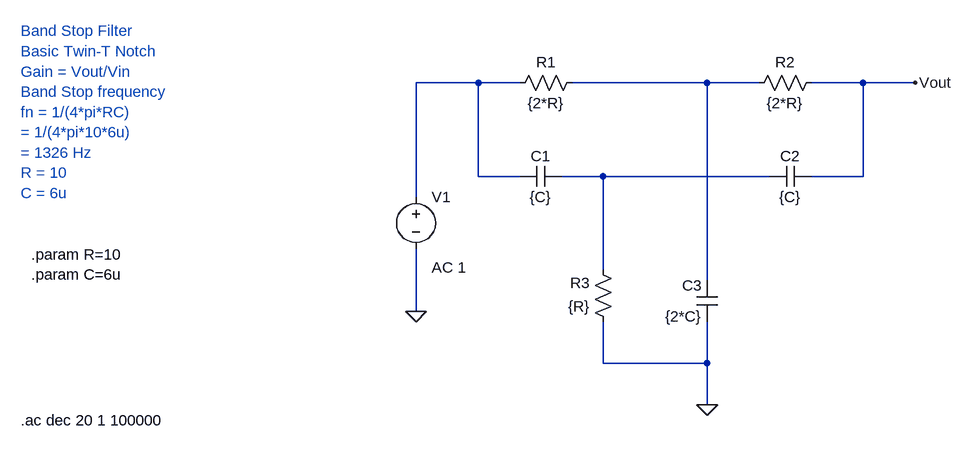
[diagram p0: schematic BandStopFilter.asc]
BandStopFilter.asc, the LTspice schematic file:
Version 4.1
SHEET 1 1368 680
WIRE 624 144 528 144
WIRE 688 144 624 144
WIRE 976 144 768 144
WIRE 1056 144 976 144
WIRE 1216 144 1136 144
WIRE 1296 144 1216 144
WIRE 624 288 624 144
WIRE 688 288 624 288
WIRE 816 288 752 288
WIRE 1072 288 816 288
WIRE 1216 288 1216 144
WIRE 1216 288 1136 288
WIRE 528 320 528 144
WIRE 816 432 816 288
WIRE 976 448 976 144
WIRE 528 496 528 400
WIRE 816 576 816 512
WIRE 976 576 976 512
WIRE 976 576 816 576
WIRE 976 640 976 576
FLAG 528 496 0
FLAG 976 640 0
FLAG 1296 144 Vout
SYMBOL voltage 528 304 R0
WINDOW 123 24 124 Left 2
WINDOW 39 0 0 Left 0
SYMATTR InstName V1
SYMATTR Value ""
SYMATTR Value2 AC 1
SYMBOL res 784 128 R90
WINDOW 0 0 56 VBottom 2
WINDOW 3 32 56 VTop 2
SYMATTR InstName R1
SYMATTR Value {2*R}
SYMBOL res 1152 128 R90
WINDOW 0 0 56 VBottom 2
WINDOW 3 32 56 VTop 2
SYMATTR InstName R2
SYMATTR Value {2*R}
SYMBOL res 832 528 R180
WINDOW 0 36 76 Left 2
WINDOW 3 36 40 Left 2
SYMATTR InstName R3
SYMATTR Value {R}
SYMBOL cap 752 272 R90
WINDOW 0 0 32 VBottom 2
WINDOW 3 32 32 VTop 2
SYMATTR InstName C1
SYMATTR Value {C}
SYMBOL cap 1136 272 R90
WINDOW 0 0 32 VBottom 2
WINDOW 3 32 32 VTop 2
SYMATTR InstName C2
SYMATTR Value {C}
SYMBOL cap 992 512 R180
WINDOW 0 24 56 Left 2
WINDOW 3 24 8 Left 2
SYMATTR InstName C3
SYMATTR Value {2*C}
TEXT -80 64 Left 2 ;Band Stop Filter\nBasic Twin-T Notch \nGain = Vout/Vin\nBand Stop frequency\nfn = 1/(4*pi*RC)\n= 1/(4*pi*10*6u)\n= 1326 Hz\nR = 10 \nC = 6u
TEXT -64 408 Left 2 !.param R=10\n.param C=6u
TEXT -80 664 Left 2 !.ac dec 20 1 100000

The netlist it stands for:
* BandStopFilter.asc
V1 N001 0 AC 1
R1 N002 N001 {2*R}
R2 Vout N002 {2*R}
R3 0 N003 {R}
C1 N003 N001 {C}
C2 Vout N003 {C}
C3 0 N002 {2*C}
* Band Stop Filter
* Basic Twin-T Notch
* Gain = Vout/Vin
* Band Stop frequency
* fn = 1/(4*pi*RC)
* = 1/(4*pi*10*6u)
* = 1326 Hz
* R = 10
* C = 6u
.param R=10
.param C=6u
.ac dec 20 1 100000
.backanno
.end